# Altium project Pinger V1.0.0.PrjPcb
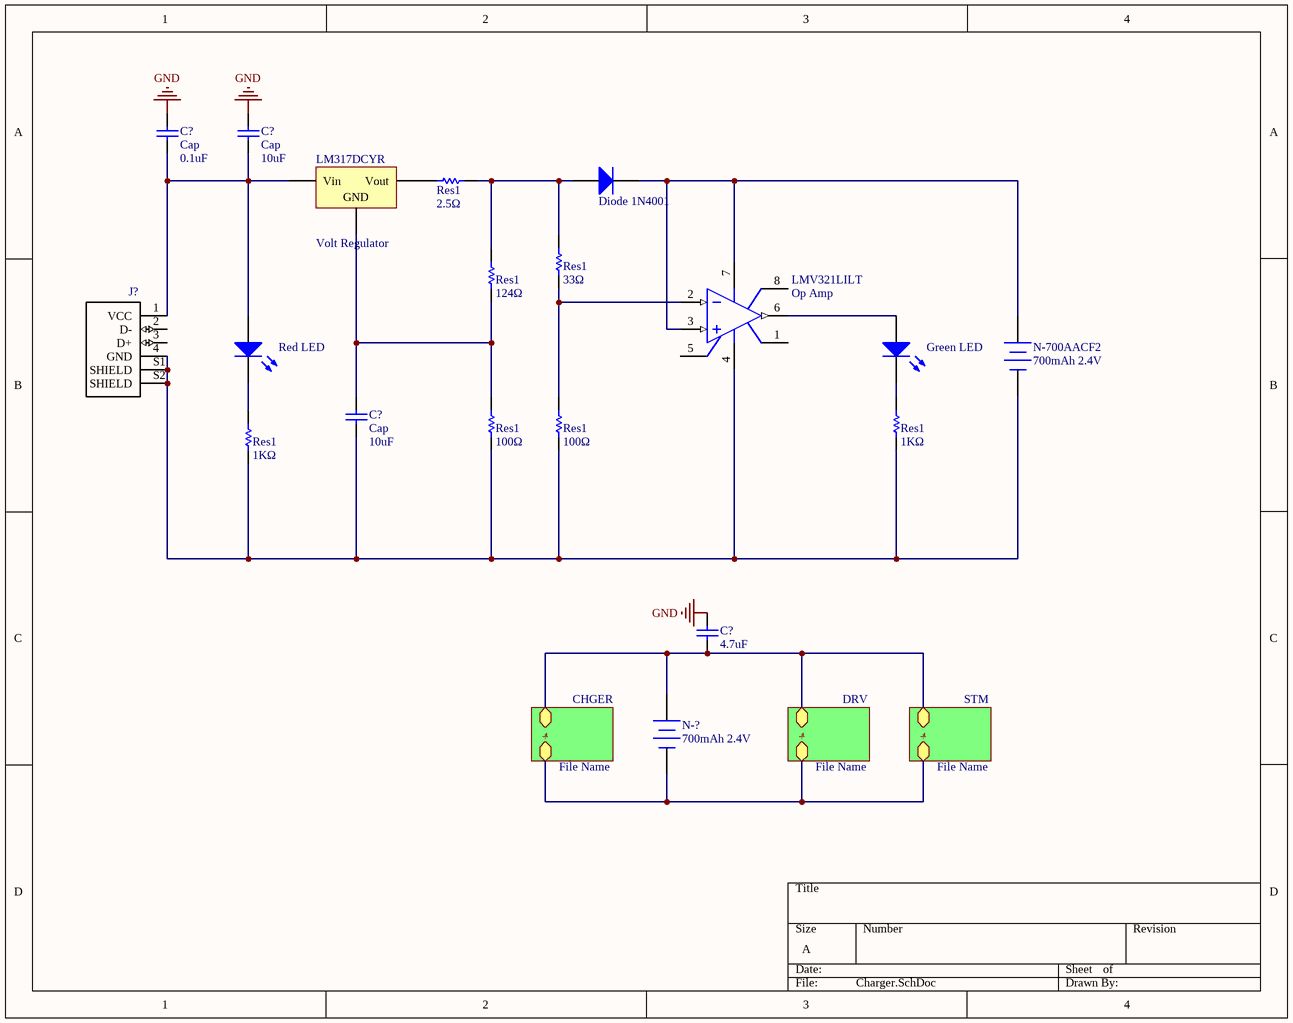
[diagram p0: Charger.SchDoc]
3 sheets, 46 parts. Net scope: hierarchical (ports join the sheet entries above them; power ports are global).
Sheets:
  Charger.SchDoc
  DRV2700.SchDoc
  MicroController.SchDoc

## Sheet Charger.SchDoc
size A

### Parts
(Parts that share a designator on the sheet are numbered #1, #2 ... from top to bottom, then left to right.)
?#1  Res1  value 2.5Ω  [AXIAL-0.3]
?#2  Diode 1N4001  [DO-41]
?#3  Res1  value 33Ω  [AXIAL-0.3]
?#4  Res1  value 124Ω  [AXIAL-0.3]
?#5  Res1  value 100Ω  [AXIAL-0.3]
?#6  Res1  value 100Ω  [AXIAL-0.3]
?#7  Res1  value 1KΩ  [AXIAL-0.3]
?#8  Res1  value 1KΩ  [AXIAL-0.3]
C?#1  Cap  value 0.1uF  [RAD-0.3]
C?#2  Cap  value 10uF  [RAD-0.3]
C?#3  Cap  value 10uF  [RAD-0.3]
C?#4  value 4.7uF  [RAD-0.3]  (hidden comment: Cap)
Green_LED  (no value)  [3.2X1.6X1.1]
J?  1-1734028-1  [*TE_1-1734028-1_1-1734028-1(Primary)]  (value not drawn)
LM317DCYR  Volt Regulator  [D2PAK_L]
LMV321LILT  Op Amp  [H-08A]
N-700AACF2  700mAh 2.4V  [BAT-2]
N-?  700mAh 2.4V  [BAT-2]
Red_LED  (no value)  [LED-1]

### Sub-sheets
CHGER = File Name (file not in this document): +, -
DRV = File Name (file not in this document): +, -
STM = File Name (file not in this document): +, -

### Nets
GND: C?#1.2 C?#2.2 C?#4.1
Net?#1_1: ?#1.1 LM317DCYR.3(Vout)
Net?#1_2: ?#1.2 ?#2.1(A) ?#3.2 ?#4.2
Net?#2_2: ?#2.2(K) LMV321LILT.3(IN+) LMV321LILT.7(V+) N-700AACF2.1(+)
Net?#3_1: ?#3.1 ?#6.2 LMV321LILT.2(IN-)
Net?#4_1: ?#4.1 ?#5.2 C?#3.2 LM317DCYR.2(GND)
Net?#5_1: ?#5.1 ?#6.1 ?#7.1 ?#8.1 C?#3.1 J?.4(GND) J?.S1(SHIELD) J?.S2(SHIELD) LMV321LILT.4(V-) N-700AACF2.2(-)
Net?#7_2: ?#7.2 Green_LED.2(K)
Net?#8_2: ?#8.2 Red_LED.2(K)
NetC?#1_1: C?#1.1 C?#2.1 J?.1(VCC) LM317DCYR.1(Vin) Red_LED.1(A)
NetC?#4_2: C?#4.2 N-?.1(+) ; sheet STM/+, sheet DRV/+, sheet CHGER/+
NetGreen_LED_1: Green_LED.1(A) LMV321LILT.6(OUT)
NetN-?_2: N-?.2(-) ; sheet STM/-, sheet DRV/-, sheet CHGER/-

Not connected (* = marked no-connect by the designer): J? 2(D-) 3(D+); LMV321LILT 1(OS_NUL) 5(OS_NUL) 8(TAB)

### Library data of the parts
?#1 ?#3-?#8 = Res1: Resistor; Published: 8-Jun-2000; LatestRevisionDate: 17-Jul-2002; LatestRevisionNote: Re-released for DXP Platform.; PackageReference: AXIAL-0.3; Publisher: Altium Limited; PackageDescription: Axial Device, Thru-Hole; 2 Leads; 0.3 in Pin Spacing
?#2 = Diode 1N4001: 1 Amp General Purpose Rectifier; Published: 8-Jun-2000; LatestRevisionDate: 17-Jul-2002; LatestRevisionNote: Re-released for DXP Platform.; DatasheetVersion: 1998; PackageVersion: Aug-1999; PackageReference: DO-41; Publisher: Altium Limited; PackageDescription: Diode, Axial; Body 5.2 x 2.7 mm (LxDia. max), Lead Dia. 0.86 mm (max); Code_JEDEC: DO-204-AL; ComponentLink1Description: Manufacturer Link; ComponentLink1URL: http://www.fairchildsemi.com/; ComponentLink2Description: Datasheet; ComponentLink2URL: http://www.fairchildsemi.com/ds/1N%2F1N4001.pdf
C?#1-C?#4 = Cap: Capacitor; Published: 8-Jun-2000; LatestRevisionDate: 17-Jul-2002; LatestRevisionNote: Re-released for DXP Platform.; PackageReference: RAD-0.3; Publisher: Altium Limited; PackageDescription: Radial Cap, Thru-Hole; 2 Leads; 0.3 in Pin Spacing
Green_LED = LED2: Typical RED, GREEN, YELLOW, AMBER GaAs LED; Published: 8-Jun-2000; LatestRevisionDate: 17-Jul-2002; LatestRevisionNote: Re-released for DXP Platform.; PackageVersion: Feb-2002; PackageReference: 3.2X1.6X1.1; Publisher: Altium Limited; PackageDescription: SM LED; 2 Flat Leads
J? = 1-1734028-1: USB CONN,Plug R/A SMT,Post 1.1,Reel; Product_Type: Connector; Centerline_Pitch: 2 mm[.078 in]; Number_of_Positions: 4; MF: TE Connectivity; Price: None; SnapEDA_Link: https://www.snapeda.com/parts/1-1734028-1/TE%20Connectivity%20AMP%20Connectors/view-part/?ref=snap; MP: 1-1734028-1; Availability: Unavailable; Package: None; TE_purchase_URL: https://www.te.com/usa-en/product-1-1734028-1.html?te_bu=Cor&te_type=disp&te_campaign=seda_glo_cor-seda-global-disp-prtnr-fy19-seda-model-bom-cta_sma-317_1&elqCampaignId=32493; Value: *
LM317DCYR = Volt Reg: Voltage Regulator; Published: 24-Mar-1999; LatestRevisionDate: 29-May-2009; LatestRevisionNote: IPC-7351 Footprint Added.; PackageReference: D2PAK; Publisher: Altium Limited; PackageDescription: 3-Pin Transistor Outline Package 2.54 mm Pitch, 15.1 mm Lead Span
LMV321LILT = Op Amp: FET Operational Amplifier; Published: 8-Jun-2000; LatestRevisionDate: 17-Jul-2002; LatestRevisionNote: Re-released for DXP Platform.; DatasheetVersion: REV. B; PackageVersion: 1990; PackageReference: H-08A; Publisher: Altium Limited; PackageDescription: Can; 8 Leads; Pin Circle Dia. 5.08 mm; Lead Dia. 0.53 mm (max); ComponentLink1Description: Manufacturer Link; ComponentLink1URL: http://www.analog.com/
N-700AACF2 N-? = Battery: Multicell Battery; Published: 24-Mar-1999; LatestRevisionDate: 17-Jul-2002; LatestRevisionNote: Re-released for DXP Platform.; PackageReference: BAT-2; Publisher: Altium Limited; PackageDescription: Battery; 2 Leads
Red_LED = LED1: Typical RED GaAs LED; Published: 8-Jun-2000; LatestRevisionDate: 08-Jul-2005; LatestRevisionNote: Mech Layer 1 removed.; PackageReference: LED-1; Publisher: Altium Limited; PackageDescription: LED; 2 Leads

## Sheet DRV2700.SchDoc
size A4
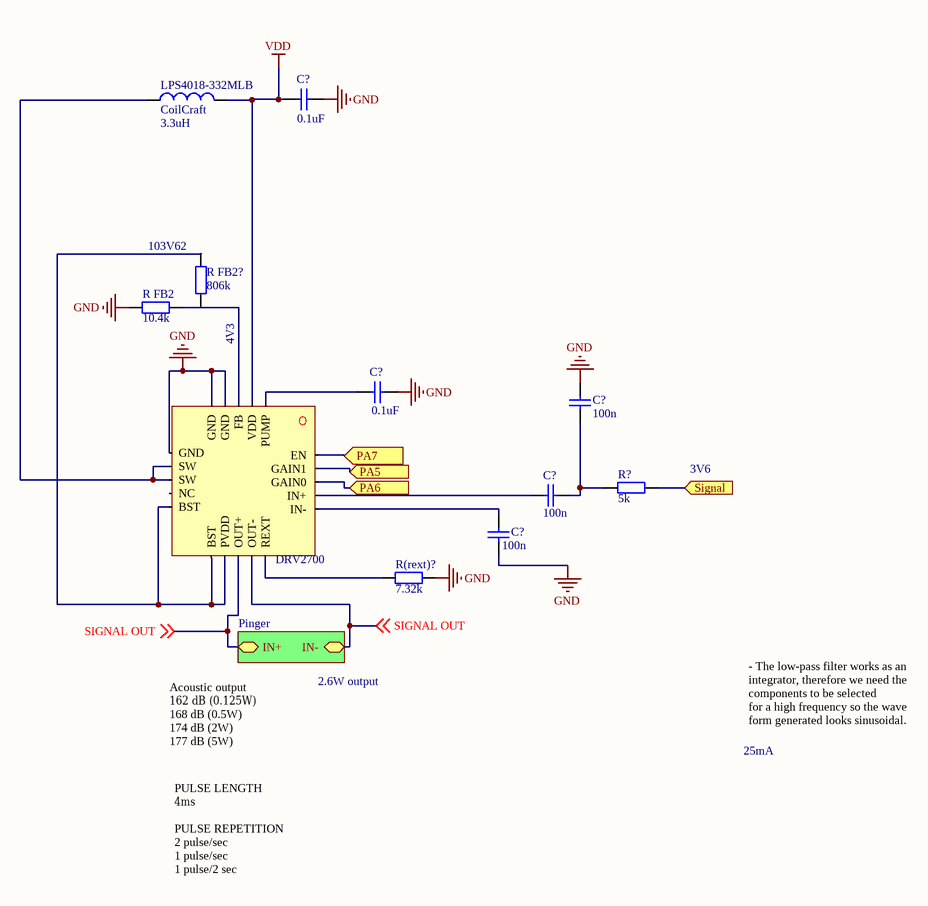
[diagram p1: DRV2700.SchDoc]

### Parts
(Parts that share a designator on the sheet are numbered #1, #2 ... from top to bottom, then left to right.)
*?#1  DRV2700
C?#5  value 0.1uF  [RAD-0.3]  (hidden comment: +10V rating and X5R or X7R)
C?#6  value 100n  [RAD-0.3]  (hidden comment: Cap)
C?#7  value 0.1uF  [RAD-0.3]  (hidden comment: +10V rating and X5R or X7R)
C?#8  value 100n  [RAD-0.3]  (hidden comment: Cap)
C?#9  value 100n  [RAD-0.3]  (hidden comment: Cap)
LPS4018-332MLB  CoilCraft  value 3.3uH  [0402-A]
R(rext)?  value 7.32k  [AXIAL-0.4]  (hidden comment: Res2)
R?#1  value 5k  [AXIAL-0.4]  (hidden comment: Res2)
R_FB2  value 10.4k  [AXIAL-0.4]  (hidden comment: Res2)
R_FB2?  value 806k  [AXIAL-0.4]  (hidden comment: Res2)

### Sub-sheets
Designator = Pinger (file not in this document): IN-, IN+

### Ports
PA5 (in), PA6 (in), PA7 (in), Signal (in)

### Nets
GND: *?#1.4(GND) *?#1.5(GND) *?#1.6(GND) C?#5.1 C?#6.1 C?#7.1 C?#9.1 R(rext)?.1 R_FB2.1
VDD: *?#1.2(VDD) C?#5.2 LPS4018-332MLB.2
SIGNAL OUT: *?#1.13(OUT+) *?#1.14(OUT-) ; off-sheet SIGNAL OUT, sheet Designator/IN-, sheet Designator/IN+
Net*?#1_1: *?#1.1(PUMP) C?#7.2
Net*?#1_3: *?#1.3(FB) R_FB2.2 R_FB2?.1
Net*?#1_7: *?#1.7(SW) *?#1.8(SW) LPS4018-332MLB.1
Net*?#1_10: *?#1.10(BST) *?#1.11(BST) *?#1.12(PVDD)
Net*?#1_15: *?#1.15(REXT) R(rext)?.2
Net*?#1_16: *?#1.16(IN-) C?#9.2
Net*?#1_17: *?#1.17(IN+) C?#8.2
Net*?#1_18: *?#1.18(GAIN0) ; port PA6
Net*?#1_19: *?#1.19(GAIN1) ; port PA5
Net*?#1_20: *?#1.20(EN) ; port PA7
NetC?#6_2: C?#6.2 C?#8.1 R?#1.1
NetR?#1_2: R?#1.2 ; port Signal

Not connected (* = marked no-connect by the designer): *?#1 9(NC); R_FB2? 2

### Notes on the sheet
- (near R_FB2?) 103V62
- 4V3
- (near R?#1) 3V6
- 2.6W output
- 25mA
- Acoustic output
  ​162 dB (0.125W)
  168 dB (0.5W)
  174 dB (2W)
  177 dB (5W)
- - The low-pass filter works as an integrator, therefore we need the components to be selected
  for a high frequency so the wave form generated looks sinusoidal.
- PULSE LENGTH
  ​4ms
  PULSE REPETITION
  2 pulse/sec
  1 pulse/sec
  1 pulse/2 sec

### Library data of the parts
C?#5-C?#9 = Cap: Capacitor; Published: 8-Jun-2000; LatestRevisionDate: 17-Jul-2002; LatestRevisionNote: Re-released for DXP Platform.; PackageReference: RAD-0.3; Publisher: Altium Limited; PackageDescription: Radial Cap, Thru-Hole; 2 Leads; 0.3 in Pin Spacing
LPS4018-332MLB = Inductor: Code_IEC: 1005; Published: 8-Jun-2000; LatestRevisionDate: 29-May-2009; LatestRevisionNote: IPC-7351 Footprint Added.; PackageReference: 0402-A; Publisher: Altium Limited; PackageDescription: Chip Inductor; Code_JEITA: 0402
R(rext)? = Res2: Current-Limiting Control Resistor; Published: 8-Jun-2000; LatestRevisionDate: 17-Jul-2002; LatestRevisionNote: Re-released for DXP Platform.; PackageReference: AXIAL-0.4; Publisher: Altium Limited; PackageDescription: Axial Device, Thru-Hole; 2 Leads; 0.4 in Pin Spacing
R?#1 R_FB2 R_FB2? = Res2: Resistor; Published: 8-Jun-2000; LatestRevisionDate: 17-Jul-2002; LatestRevisionNote: Re-released for DXP Platform.; PackageReference: AXIAL-0.4; Publisher: Altium Limited; PackageDescription: Axial Device, Thru-Hole; 2 Leads; 0.4 in Pin Spacing
*?#1 = DRV2700: Supplier 1: Mouser; Supplier Part Number 1: 595-DRV2700RGPT

## Sheet MicroController.SchDoc
size A4; CompanyName: AUVIC; DrawnBy: Aman Nijjar; Organization: AUVIC; DocumentNumber: 2; Revision: 0; SheetNumber: 2; SheetTotal: 3; DocumentName: Pinger; ProjectName: Pinger
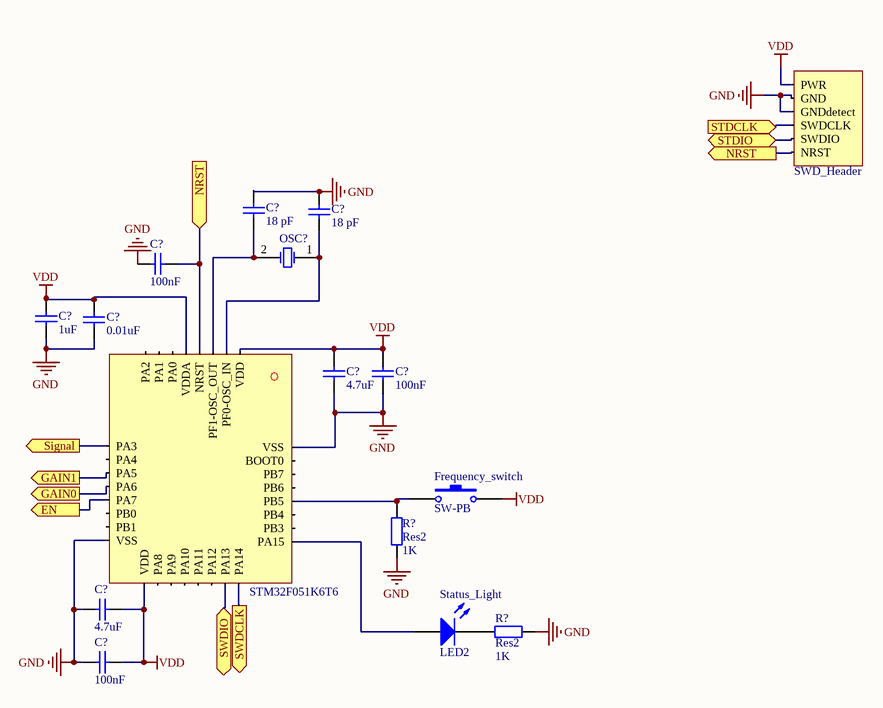
[diagram p2: MicroController.SchDoc]

### Parts
(Parts that share a designator on the sheet are numbered #1, #2 ... from top to bottom, then left to right.)
*?#2  SWD_Header  [Male_header]
*?#3  STM32F051K6T6  [TQFP68P900X900X160-32N]
C?#10  value 18 pF  [RAD-0.3]  (hidden comment: Cap)
C?#11  value 18 pF  [RAD-0.3]  (hidden comment: Cap)
C?#12  value 100nF  [RAD-0.3]  (hidden comment: Cap)
C?#13  value 1uF  [RAD-0.3]  (hidden comment: Cap)
C?#14  value 0.01uF  [RAD-0.3]  (hidden comment: Cap)
C?#15  value 4.7uF  [RAD-0.3]  (hidden comment: Cap)
C?#16  value 100nF  [RAD-0.3]  (hidden comment: Cap)
C?#17  value 4.7uF  [RAD-0.3]  (hidden comment: Cap)
C?#18  value 100nF  [RAD-0.3]  (hidden comment: Cap)
Frequency_switch  SW-PB  [SPST-2]
OSC?  ABMM2-14.7456MHZ-E2-T  [R38]  (value not drawn)
R?#2  Res2  value 1K  [AXIAL-0.4]
R?#3  Res2  value 1K  [AXIAL-0.4]
Status_Light  LED2  [3.2X1.6X1.1]

### Ports
EN (out), GAIN0 (out), GAIN1 (out), NRST (in), NRST (out), Signal (out), STDCLK (in), STDIO (bidir), SWDCLK (out), SWDIO (bidir)

### Nets
GND: *?#2.2(GND) *?#2.3(GNDdetect) *?#3.16(VSS) *?#3.32(VSS) C?#10.2 C?#11.2 C?#12.1 C?#13.2 C?#14.2 C?#15.2 C?#16.2 C?#17.2 C?#18.2 R?#2.2 R?#3.2
VDD: *?#2.1(PWR) *?#3.1(VDD) *?#3.5(VDDA) *?#3.17(VDD) C?#13.1 C?#14.1 C?#15.1 C?#16.1 C?#17.1 C?#18.1 Frequency_switch.2
Net*?#2_4: *?#2.4(SWDCLK) ; port STDCLK
Net*?#2_5: *?#2.5(SWDIO) ; port STDIO
Net*?#2_6: *?#2.6(NRST) *?#3.4(NRST) C?#12.2 ; port NRST
Net*?#3_2: *?#3.2(PF0-OSC_IN) C?#11.1 OSC?.1(OSC1)
Net*?#3_3: *?#3.3(PF1-OSC_OUT) C?#10.1 OSC?.2(OSC2)
Net*?#3_9: *?#3.9(PA3) ; port Signal
Net*?#3_11: *?#3.11(PA5) ; port GAIN1
Net*?#3_12: *?#3.12(PA6) ; port GAIN0
Net*?#3_13: *?#3.13(PA7) ; port EN
Net*?#3_23: *?#3.23(PA13) ; port SWDIO
Net*?#3_24: *?#3.24(PA14) ; port SWDCLK
Net*?#3_25: *?#3.25(PA15) Status_Light.1(A)
Net*?#3_28: *?#3.28(PB5) Frequency_switch.1 R?#2.1
NetR?#3_1: R?#3.1 Status_Light.2(K)

Not connected (* = marked no-connect by the designer): *?#3 6(PA0) 7(PA1) 8(PA2) 10(PA4) 14(PB0) 15(PB1) 18(PA8) 19(PA9) 20(PA10) 21(PA11) 22(PA12) 26(PB3) 27(PB4) 29(PB6) 30(PB7) 31(BOOT0)

### Library data of the parts
C?#10-C?#18 = Cap: Capacitor; Published: 8-Jun-2000; LatestRevisionDate: 17-Jul-2002; LatestRevisionNote: Re-released for DXP Platform.; PackageReference: RAD-0.3; Publisher: Altium Limited; PackageDescription: Radial Cap, Thru-Hole; 2 Leads; 0.3 in Pin Spacing
Frequency_switch = SW-PB: Switch; Published: 24-Mar-1999; LatestRevisionDate: 17-Jul-2002; LatestRevisionNote: Re-released for DXP Platform.; PackageReference: SPST-2; Publisher: Altium Limited; PackageDescription: Switch; 2 Leads
OSC? = XTAL: Crystal Oscillator; Published: 8-Jun-2000; LatestRevisionDate: 17-Jul-2002; LatestRevisionNote: Re-released for DXP Platform.; PackageReference: R38; Publisher: Altium Limited; PackageDescription: Crystal, Thru-Hole; 2 Leads; Body 3.1 x 8.2 mm (Dia.xH)
R?#2 R?#3 = Res2: Resistor; Published: 8-Jun-2000; LatestRevisionDate: 17-Jul-2002; LatestRevisionNote: Re-released for DXP Platform.; PackageReference: AXIAL-0.4; Publisher: Altium Limited; PackageDescription: Axial Device, Thru-Hole; 2 Leads; 0.4 in Pin Spacing
Status_Light = LED2: as Green_LED on sheet Charger; Published: 8-Jun-2000; LatestRevisionDate: 17-Jul-2002; LatestRevisionNote: Re-released for DXP Platform.; PackageVersion: Feb-2002; PackageReference: 3.2X1.6X1.1; Publisher: Altium Limited; PackageDescription: SM LED; 2 Flat Leads
*?#3 = STM32F051K6T6: Supplier 1: Mouser; Supplier Part Number 1: 511-STM32F051K6T6

## Nets that join several sheets
GND: Charger (C?#1.2 C?#2.2 C?#4.1), DRV2700 (9 pins), MicroController (15 pins)
VDD: DRV2700 (*?#1.2 C?#5.2 LPS4018-332MLB.2), MicroController (11 pins)